# Altium project Valve.PrjPcb
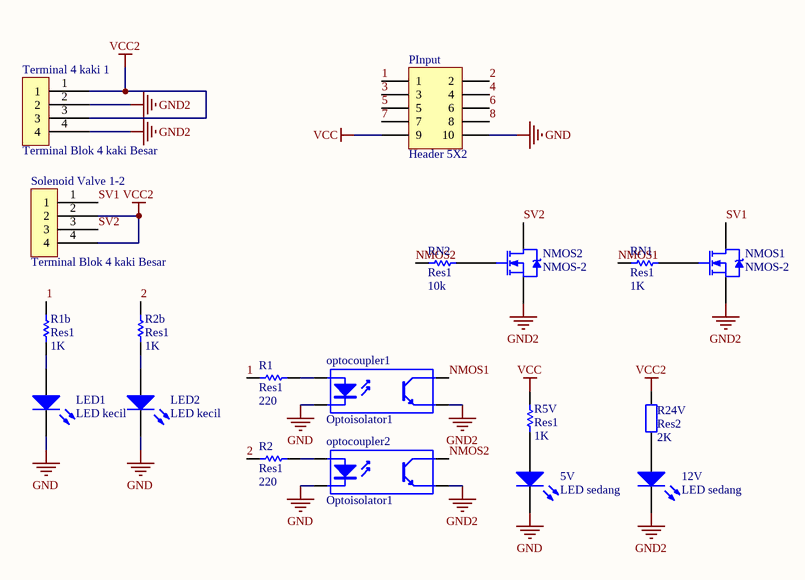
[diagram p0: Valve.SchDoc]
1 sheet, 19 parts. Net scope: global (net labels, ports and power ports of the same name join across sheets).
Board file: Valve.PcbDoc

## Sheet Valve.SchDoc
size A3

### Parts
5V  LED sedang  [LED sedang]
12V  LED sedang  [LED sedang]
LED1  LED kecil  [LED kecil]
LED2  LED kecil  [LED kecil]
NMOS1  NMOS-2  [TO-220AB]
NMOS2  NMOS-2  [TO-220AB]
optocoupler1  Optoisolator1  [DIP-4]
optocoupler2  Optoisolator1  [DIP-4]
PInput  Header 5X2  [HDR2X5]
R1  Res1  value 220  [AXIAL-0.3]
R1b  Res1  value 1K  [AXIAL-0.3]
R2  Res1  value 220  [AXIAL-0.3]
R2b  Res1  value 1K  [AXIAL-0.3]
R5V  Res1  value 1K  [AXIAL-0.3]
R24V  Res2  value 2K  [AXIAL-0.4]
RN1  Res1  value 1K  [AXIAL-0.3]
RN2  Res1  value 10k  [AXIAL-0.3]
Solenoid_Valve_1-2  Terminal Blok 4 kaki Besar  [TERMINAL 4 KAKI]
Terminal_4_kaki_1  Terminal Blok 4 kaki Besar  [TERMINAL 4 KAKI]

### Nets
GND: 5V.2(K) LED1.2(K) LED2.2(K) optocoupler1.2(K) optocoupler2.2(K) PInput.10
GND2: 12V.2(K) NMOS1.3(S) NMOS2.3(S) optocoupler1.3(E) optocoupler2.3(E) Terminal_4_kaki_1.2 Terminal_4_kaki_1.4
VCC: PInput.9 R5V.2
VCC2: R24V.2 Solenoid_Valve_1-2.2 Solenoid_Valve_1-2.4 Terminal_4_kaki_1.1 Terminal_4_kaki_1.3
1: PInput.1 R1.1 R1b.2
2: PInput.2 R2.1 R2b.2
3: PInput.3
4: PInput.4
5: PInput.5
6: PInput.6
7: PInput.7
8: PInput.8
NMOS1: optocoupler1.4(C) RN1.1
NMOS2: optocoupler2.4(C) RN2.1
SV1: NMOS1.2(D) Solenoid_Valve_1-2.1
SV2: NMOS2.2(D) Solenoid_Valve_1-2.3
Net5V_1: 5V.1(A) R5V.1
Net12V_1: 12V.1(A) R24V.1
NetLED1_1: LED1.1(A) R1b.1
NetLED2_1: LED2.1(A) R2b.1
NetNMOS1_1: NMOS1.1(G) RN1.2
NetNMOS2_1: NMOS2.1(G) RN2.2
Netoptocoupler1_1: optocoupler1.1(A) R1.2
Netoptocoupler2_1: optocoupler2.1(A) R2.2

### Notes on the sheet
- Title
- Size:
- Date:
- A3
- Number:
- Time:
- Revision:
- Sheet
- of
- File:

### Library data of the parts
NMOS1 NMOS2 = NMOS-2: N-Channel Power MOSFET; Note: Pin 2 is electrically connected to pin 4.; Published: 8-Jun-2000; LatestRevisionDate: 17-Jul-2002; LatestRevisionNote: Re-released for DXP Platform.; DatasheetVersion: PD-9.814; PackageVersion: Feb-1997; PackageReference: TO-220AB; Publisher: Altium Limited; PackageDescription: TO, Thru-Hole, Vertical, Heatsink Mounted; 3 In-Line Leads; Pitch 2.54 mm; ComponentLink1Description: Manufacturer Link; ComponentLink1URL: http://www.irf.com/
optocoupler1 optocoupler2 = Optoisolator1: 4-Pin Phototransistor Optocoupler; Published: 24-Mar-1999; LatestRevisionDate: 04-Mar-2005; LatestRevisionNote: Sch pins 3 & 4 Swapped.; DatasheetVersion: Nov-2003; PackageReference: DIP-4; Publisher: Altium Limited
PInput = Header 5X2: Header, 5-Pin, Dual row; LatestRevisionDate: 17-Jul-2002; LatestRevisionNote: Re-released for DXP Platform.; Publisher: Altium Limited
R1 R1b R2 R2b R5V RN1 RN2 = Res1: Resistor; Published: 8-Jun-2000; LatestRevisionDate: 17-Jul-2002; LatestRevisionNote: Re-released for DXP Platform.; PackageReference: AXIAL-0.3; Publisher: Altium Limited
R24V = Res2: Resistor; Published: 8-Jun-2000; LatestRevisionDate: 17-Jul-2002; LatestRevisionNote: Re-released for DXP Platform.; PackageReference: AXIAL-0.4; Publisher: Altium Limited
Solenoid_Valve_1-2 Terminal_4_kaki_1 = Terminal Blok 4 kaki